# Altium project canDrive_hw_board1_v2.PrjPcb
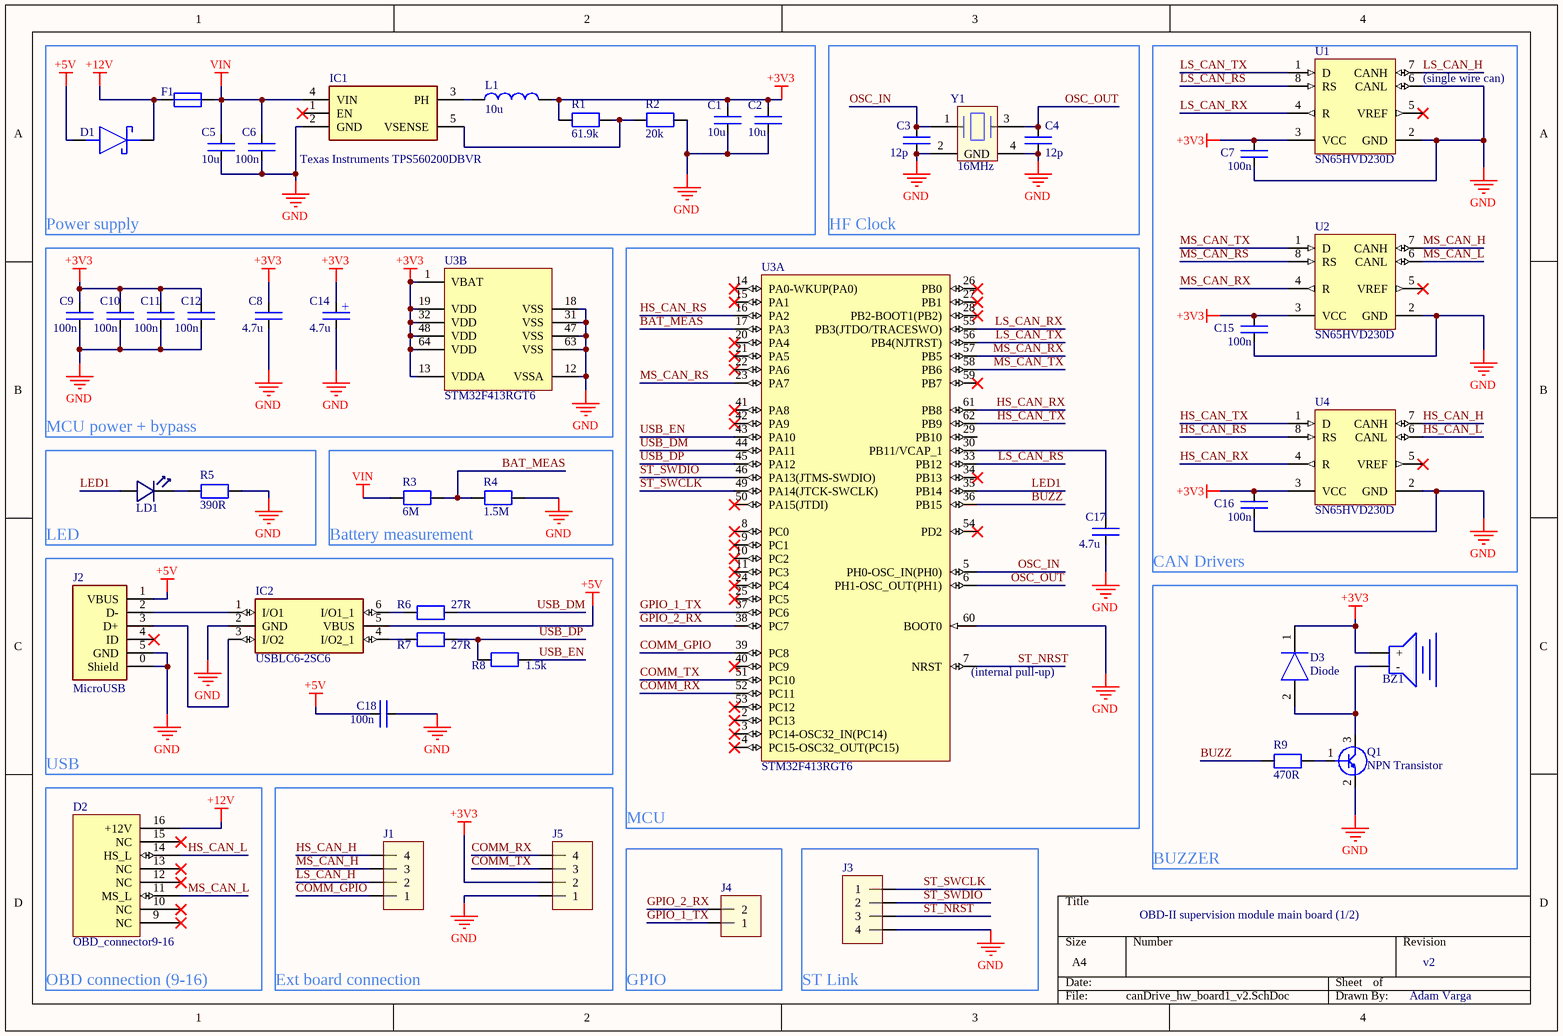
[diagram p0: canDrive_hw_board1_v2.SchDoc]
1 sheet, 46 parts. Net scope: global (net labels, ports and power ports of the same name join across sheets).
Board file: canDrive_hw_board1_v2.PcbDoc

## Sheet canDrive_hw_board1_v2.SchDoc
size A4

### Parts
BZ1  Buzzer  [52x52_buzzer]  (value not drawn)
C1  value 10u  [C0603]  (hidden comment: Capacitor)
C2  value 10u  [C0603]  (hidden comment: Capacitor)
C3  value 12p  [C0603]  (hidden comment: Capacitor)
C4  value 12p  [C0603]  (hidden comment: Capacitor)
C5  value 10u  [C0603]
C6  value 100n  [C0603]
C7  value 100n  [C0603]  (hidden comment: Capacitor)
C8  value 4.7u  [C0603]  (hidden comment: Capacitor)
C9  value 100n  [C0603]  (hidden comment: Capacitor)
C10  value 100n  [C0603]  (hidden comment: Capacitor)
C11  value 100n  [C0603]  (hidden comment: Capacitor)
C12  value 100n  [C0603]  (hidden comment: Capacitor)
C14  value 4.7u  [CAP3216X180N_polar]  (hidden comment: Capacitor_polarized)
C15  value 100n  [C0603]  (hidden comment: Capacitor)
C16  value 100n  [C0603]  (hidden comment: Capacitor)
C17  value 4.7u  [C0603]  (hidden comment: Capacitor)
C18  value 100n  [C0603]  (hidden comment: Capacitor)
D1  (no value)  [SODFL3516X120N]
D2  OBD_connector9-16  [OBD9-16]
D3  Diode  [CD0603S01575]
F1  (no value)  [FUSE 1206]
IC1  Name: Texas Instruments TPS560200DBVR  [SOT95P280X145-5N]
IC2  USBLC6-2SC6  [SOT95P280X145-6N]
J1  CON_1x4  [127mm_header_4pin]  (value not drawn)
J2  micro_usb_female  [micro_usb]  (value not drawn)
J3  CON_1x4  [ribbon4pin]  (value not drawn)
J4  CON_1x2  [ribbon2pin]  (value not drawn)
J5  CON_1x4  [127mm_header_4pin]  (value not drawn)
L1  value 10u  [inductor]  (hidden comment: Inductor)
LD1  LED  [LED_0603]  (value not drawn)
Q1  NPN Transistor  [SOT95P230X110-3N]
R1  value 61.9k  [R0603]  (hidden comment: Resistor)
R2  value 20k  [R0603]  (hidden comment: Resistor)
R3  value 6M  [R0603]  (hidden comment: Resistor)
R4  value 1.5M  [R0603]  (hidden comment: Resistor)
R5  value 390R  [R0603]  (hidden comment: Resistor)
R6  value 27R  [R0603]  (hidden comment: Resistor)
R7  value 27R  [R0603]  (hidden comment: Resistor)
R8  value 1.5k  [R0603]  (hidden comment: Resistor)
R9  value 470R  [R0603]  (hidden comment: Resistor)
U1  SN65HVD230D  [SN65HVD230D_N]
U2  SN65HVD230D  [SN65HVD230D_N]
U3  STM32F413RGT6  [STM32F413RGT6_LQFP64_MFG]  (parts A,B of 2)
U4  SN65HVD230D  [SN65HVD230D_N]
Y1  value 16MHz  [25x20_osc]  (hidden comment: OSC_16MHZ_25x20)

### Blocks framed on the sheet
Power supply: C1 C2 C5 C6 D1 F1 IC1 L1 R1 R2
HF Clock: C3 C4 Y1
CAN Drivers: C7 C15 C16 U1 U2 U4
MCU: C17 U3
Battery measurement: R3 R4
Ext board connection: J1 J5
GPIO: J4
ST Link: J3

### Nets
+3V3: BZ1.0(+) C1.1 C2.1 C7.1 C8.1 C9.1 C10.1 C11.1 C12.1 C14.1 C15.1 C16.1 D3.1(K) J5.2 L1.2 R1.0 U1.3(VCC) U2.3(VCC) U3.1(VBAT) U3.13(VDDA) U3.19(VDD) U3.32(VDD) U3.48(VDD) U3.64(VDD) U4.3(VCC)
+5V: C18.1 D1.2(A) IC2.5(VBUS) J2.1(VBUS)
+12V: D1.1(K) D2.16(+12V) F1.1
GND: C1.0 C2.0 C3.0 C4.0 C5.0 C6.0 C7.0 C8.0 C9.0 C10.0 C11.0 C12.0 C14.2 C15.0 C16.0 C17.0 C18.0 IC1.2(GND) IC2.2(GND) J2.0(Shield) J2.5(GND) J3.4 J5.1 Q1.2(E) R2.1 R4.1 R5.0 U1.2(GND) U1.6(CANL) U2.2(GND) U3.12(VSSA) U3.18(VSS) U3.31(VSS) U3.47(VSS) U3.60(BOOT0) U3.63(VSS) U4.2(GND) Y1.2(GND) Y1.4(GND)
VIN: C5.1 C6.1 F1.2 IC1.4(VIN) R3.0
BAT_MEAS: R3.1 R4.0 U3.17(PA3)
BUZZ: R9.1 U3.36(PB15)
COMM_GPIO: J1.1 U3.39(PC8)
COMM_RX: J5.4 U3.52(PC11)
COMM_TX: J5.3 U3.51(PC10)
GPIO_1_TX: J4.1 U3.37(PC6)
GPIO_2_RX: J4.2 U3.38(PC7)
HS_CAN_H: J1.4 U4.7(CANH)
HS_CAN_L: D2.14(HS_L) U4.6(CANL)
HS_CAN_RS: U3.16(PA2) U4.8(RS)
HS_CAN_RX: U3.61(PB8) U4.4(R)
HS_CAN_TX: U3.62(PB9) U4.1(D)
LED1: LD1.A U3.35(PB14)
LS_CAN_H: J1.2 U1.7(CANH)
LS_CAN_RS: U1.8(RS) U3.33(PB12)
LS_CAN_RX: U1.4(R) U3.55(PB3(JTDO/TRACESWO))
LS_CAN_TX: U1.1(D) U3.56(PB4(NJTRST))
MS_CAN_H: J1.3 U2.7(CANH)
MS_CAN_L: D2.11(MS_L) U2.6(CANL)
MS_CAN_RS: U2.8(RS) U3.23(PA7)
MS_CAN_RX: U2.4(R) U3.57(PB5)
MS_CAN_TX: U2.1(D) U3.58(PB6)
OSC_IN: C3.1 U3.5(PH0-OSC_IN(PH0)) Y1.1(1_HOT)
OSC_OUT: C4.1 U3.6(PH1-OSC_OUT(PH1)) Y1.3(2_HOT)
ST_NRST: J3.3 U3.7(NRST)
ST_SWCLK: J3.1 U3.49(PA14(JTCK-SWCLK))
ST_SWDIO: J3.2 U3.46(PA13(JTMS-SWDIO))
USB_DM: R6.1 U3.44(PA11)
USB_DP: R7.1 R8.0 U3.45(PA12)
USB_EN: R8.1 U3.43(PA10)
NetBZ1_1: BZ1.1(-) D3.2(A) Q1.3(C)
NetC17_1: C17.1 U3.30(PB11/VCAP_1)
NetIC1_3: IC1.3(PH) L1.1
NetIC1_5: IC1.5(VSENSE) R1.1 R2.0
NetIC2_1: IC2.1(I/O1) J2.2(D-)
NetIC2_3: IC2.3(I/O2) J2.3(D+)
NetIC2_4: IC2.4(I/O2_1) R7.0
NetIC2_6: IC2.6(I/O1_1) R6.0
NetLD1_C: LD1.C R5.1
NetQ1_1: Q1.1(B) R9.0

Not connected (* = marked no-connect by the designer): D2 9(NC)* 10(NC)* 12(NC)* 13(NC)* 15(NC)*; IC1 1(EN)*; J2 4(ID)*; U1 5(VREF)*; U2 5(VREF)*; U3 2(PC13)* 3(PC14-OSC32_IN(PC14))* 4(PC15-OSC32_OUT(PC15))* 8(PC0)* 9(PC1)* 10(PC2)* 11(PC3)* 14(PA0-WKUP(PA0))* 15(PA1)* 20(PA4)* 21(PA5)* 22(PA6)* 24(PC4)* 25(PC5)* 26(PB0)* 27(PB1)* 28(PB2-BOOT1(PB2))* 29(PB10) 34(PB13)* 40(PC9)* 41(PA8)* 42(PA9)* 50(PA15(JTDI))* 53(PC12)* 54(PD2)* 59(PB7)*; U4 5(VREF)*

### Notes on the sheet
- (near U1) (single wire can)
- MCU power + bypass
- LED
- (near U3) (internal pull-up)
- USB
- OBD-II supervision module main board (1/2)
- BUZZER
- (near D2) OBD connection (9-16)
- v2
- Adam Varga
- (in symbol Capacitor_polarized) +
- (in symbol micro_usb_female) MicroUSB

### Library data of the parts
BZ1 = Buzzer: Loudness: 80dB; Link: https://lcsc.com/product-detail/Buzzers_Jiangsu-Huaneng-Elec-MLT-5020_C94598.html; Price: $0.4061
C3 C4 = Capacitor: Name: Murata Electronics GCM1885C1H120FA16D; Link: https://lcsc.com/product-detail/Multilayer-Ceramic-Capacitors-MLCC-SMD-SMT_MuRata_GCM1885C1H120FA16D_12pF-120-1-50V-Car-level_C126545.html
C5 = Capacitor: Link: https://lcsc.com/product-detail/Multilayer-Ceramic-Capacitors-MLCC-SMD-SMT_Murata-Electronics-GRM188R61E106MA73D_C91606.html
C6 = Capacitor: Part: C119027; Link: https://lcsc.com/product-detail/Multilayer-Ceramic-Capacitors-MLCC-SMD-SMT_Walsin-Tech-Corp-0603B104J500CT_C119027.html
C14 = Capacitor_polarized: Capacitor; Link: https://lcsc.com/product-detail/Tantalum-Capacitors_AVX_TAJA475K016RNJ_4-7uF-475-10-16V_C7187.html
D1 = PMEG4005EH,115: Schottky Diode; Fordward voltage: 420-470mV; Forward current: 500mA; Reverse current: 7-20uA; Name: Nexperia PMEG4005EH,115; Link: https://lcsc.com/product-detail/Schottky-Barrier-Diodes-SBD_Nexperia-PMEG4005EH-115_C133636.html; Price: $0.0588
D2 = OBD9-16
F1 = Fuse: Nominal Voltage Drop: 89.1mV; Name: Littelfuse 0494001.NR; Current rating: 1A; Link: https://lcsc.com/product-detail/Surface-Mount-Fuses_Littelfuse_0494001-NR_Littelfuse-0494001-NR_C142652.html; Price: $0.0429
IC1 = TPS560200DBVR: Integrated Circuit; Output current: 500mA; Output voltage: 3.3V; Input voltage max: 17; Link: https://lcsc.com/product-detail/DC-DC-Converters_TI_TPS560200DBVR_TPS560200DBVR_C83671.html; Price: $0.2455
IC2 = USBLC6-2SC6: Integrated Circuit; Name: USBLC6-2SC6; Link: https://lcsc.com/product-detail/Diodes-ESD_STMicroelectronics_USBLC6-2SC6_USBLC6-2SC6_C7519.html; Price: $0.0788
J1 J3 J5 = CON_1x4: 1x4 connector; Type: DF57H-4P-1.2V Hirose HDR Lighting Connector
J2 = micro_usb_female: Name: Korean Hroparts Elec U-F-M5DD-W-L; Link: https://lcsc.com/product-detail/Micro-USB-Connectors_Korean-Hroparts-Elec-U-F-M5DD-W-L_C145792.html; Price: $0.0965
J4 = CON_1x2: 1x4 connector; Type: DF57H-4P-1.2V Hirose HDR Lighting Connector
L1 = Inductor: Rated current: 2.2A; DC Resistance: 56mOhm; Name: Murata Electronics LQH5BPN100M38L; Link: https://lcsc.com/product-detail/Inductors-SMD_Murata-Electronics_LQH5BPN100M38L_Murata-Electronics-LQH5BPN100M38L_C237555.html; Price: $0.1682
LD1 = LED: Name: Orient ORH-G36G; Link: https://lcsc.com/product-detail/Light-Emitting-Diodes-LED_0603-green_C205443.html
Q1 = NPN Transistor: Transistor BJT NPN; Link: https://lcsc.com/product-detail/Transistors-NPN-PNP_NXP_PMBT3904_PMBT3904_C8667.html
R2 = Resistor: Part: C137817; Link: https://lcsc.com/product-detail/_RC0603DR-0720KL_C137817.html
U1 U2 U4 = SN65HVD230D: CAN Bus Transceiver, 3.3 V, -40 to 85 degC, 8-Pin SOIC (D), Green (RoHS & no Sb/Br), Tube; Name: SN65HVD230D; Link: https://lcsc.com/product-detail/CAN-ICs_Texas-Instruments-SN65HVD230DR_C12084.html; Price: $0.6379
U3 = CMP-0243-00023-3: ARM Cortex-M4 32-bit MCU+FPU, 210 DMIPS, 1024 kB Flash, 192 kB Internal RAM, 51 I/Os, 64-pin LQFP, -40 to 85 degC, Tray; Manufacturer: STMicroelectronics; PartNumber: STM32F413RHT6; FLASH Size (Prog) (kB): 1024; Supply Voltage(Vcc) max (V): 3.6; Operating Frequency(F) (Processor speed) (MHz): 168; D/A Converter: 2x12-bit; Supply Voltage(Vcc) min (V): 1.8; Internal RAM Size (kB): 192; I/Os (High Current): 51; PackageReference: LQFP64; ComponentLink1Description: Manufacturer URL; ComponentLink1URL: http://www.st.com/web/en/home.html; ComponentLink2URL: http://www.st.com/st-web-ui/static/active/en/resource/technical/document/datasheet/DM00035129.pdf; Packing: Tray; Core: ARM Cortex-M4; ComponentLink3Description: Package Specification; PackageDescription: 64-Pin Low Profile Quad Flat Package, 10 x 10 mm Body, 0.5 mm Pitch; Mounting Technology: Surface Mount; ComponentLink3URL: http://www.st.com/st-web-ui/static/active/en/resource/technical/document/datasheet/DM00037051.pdf; PackageVersion: Rev. 4, 06/2013; ComponentLink2Description: Datasheet; DatasheetVersion: Rev. 4
Y1 = OSC_16MHZ_25x20: Name: Harmony Elec X2B016000BC1H-HV; ESR: 50Ohm; Link: https://lcsc.com/product-detail/SMD-Crystal-Resonators_Harmony-Elec-X2B016000BC1H-HV_C254310.html; Price: $0.1561
C1 C2 C7-C12 C15-C18 = Capacitor
  C1 C2: Link: https://lcsc.com/product-detail/Multilayer-Ceramic-Capacitors-MLCC-SMD-SMT_Murata-Electronics-GRM188R61E106MA73D_C91606.html
  C8 C17: Link: https://lcsc.com/product-detail/Multilayer-Ceramic-Capacitors-MLCC-SMD-SMT_SAMSUNG_CL10A475KO8NNNC_4-7uF-475-10-16V_C19666.html
D3 = Diode: Link: https://lcsc.com/product-detail/Switching-Diode_BOURNS_CD0603-S01575_CD0603-S01575_C143804.html
R1 R3-R9 = Resistor
  R1: Link: https://lcsc.com/product-detail/Others_YAGEO-AC0603FR-0761K9L_C227997.html
  R3: Link: https://lcsc.com/product-detail/Others_Guangdong-Fenghua-Advanced-Tech-RS-03L6044FT_C322196.html
  R4: Link: https://lcsc.com/product-detail/Others_Guangdong-Fenghua-Advanced-Tech-RS-03L1544FT_C322058.html
  R5: Link: https://lcsc.com/product-detail/Chip-Resistor-Surface-Mount_390R-390R-1_C114620.html
  R6 R7: Link: https://lcsc.com/product-detail/Chip-Resistor-Surface-Mount_Uniroyal-Elec-0603WAJ0270T5E_C25224.html
  R8: Link: https://lcsc.com/product-detail/Chip-Resistor-Surface-Mount_1-5KR-1501-1_C114668.html
  R9: Link: https://lcsc.com/product-detail/Chip-Resistor-Surface-Mount_470R-470R-1_C114669.html